# Altium schematic sheet SCH_WINGLET_GNSS.SchDoc: Winglet GNSS
size B; DrawnBy: HCAdam; Organization: Aerospace Village; DocumentNumber: WINGLET; Revision: A; SheetNumber: 7; SheetTotal: 10
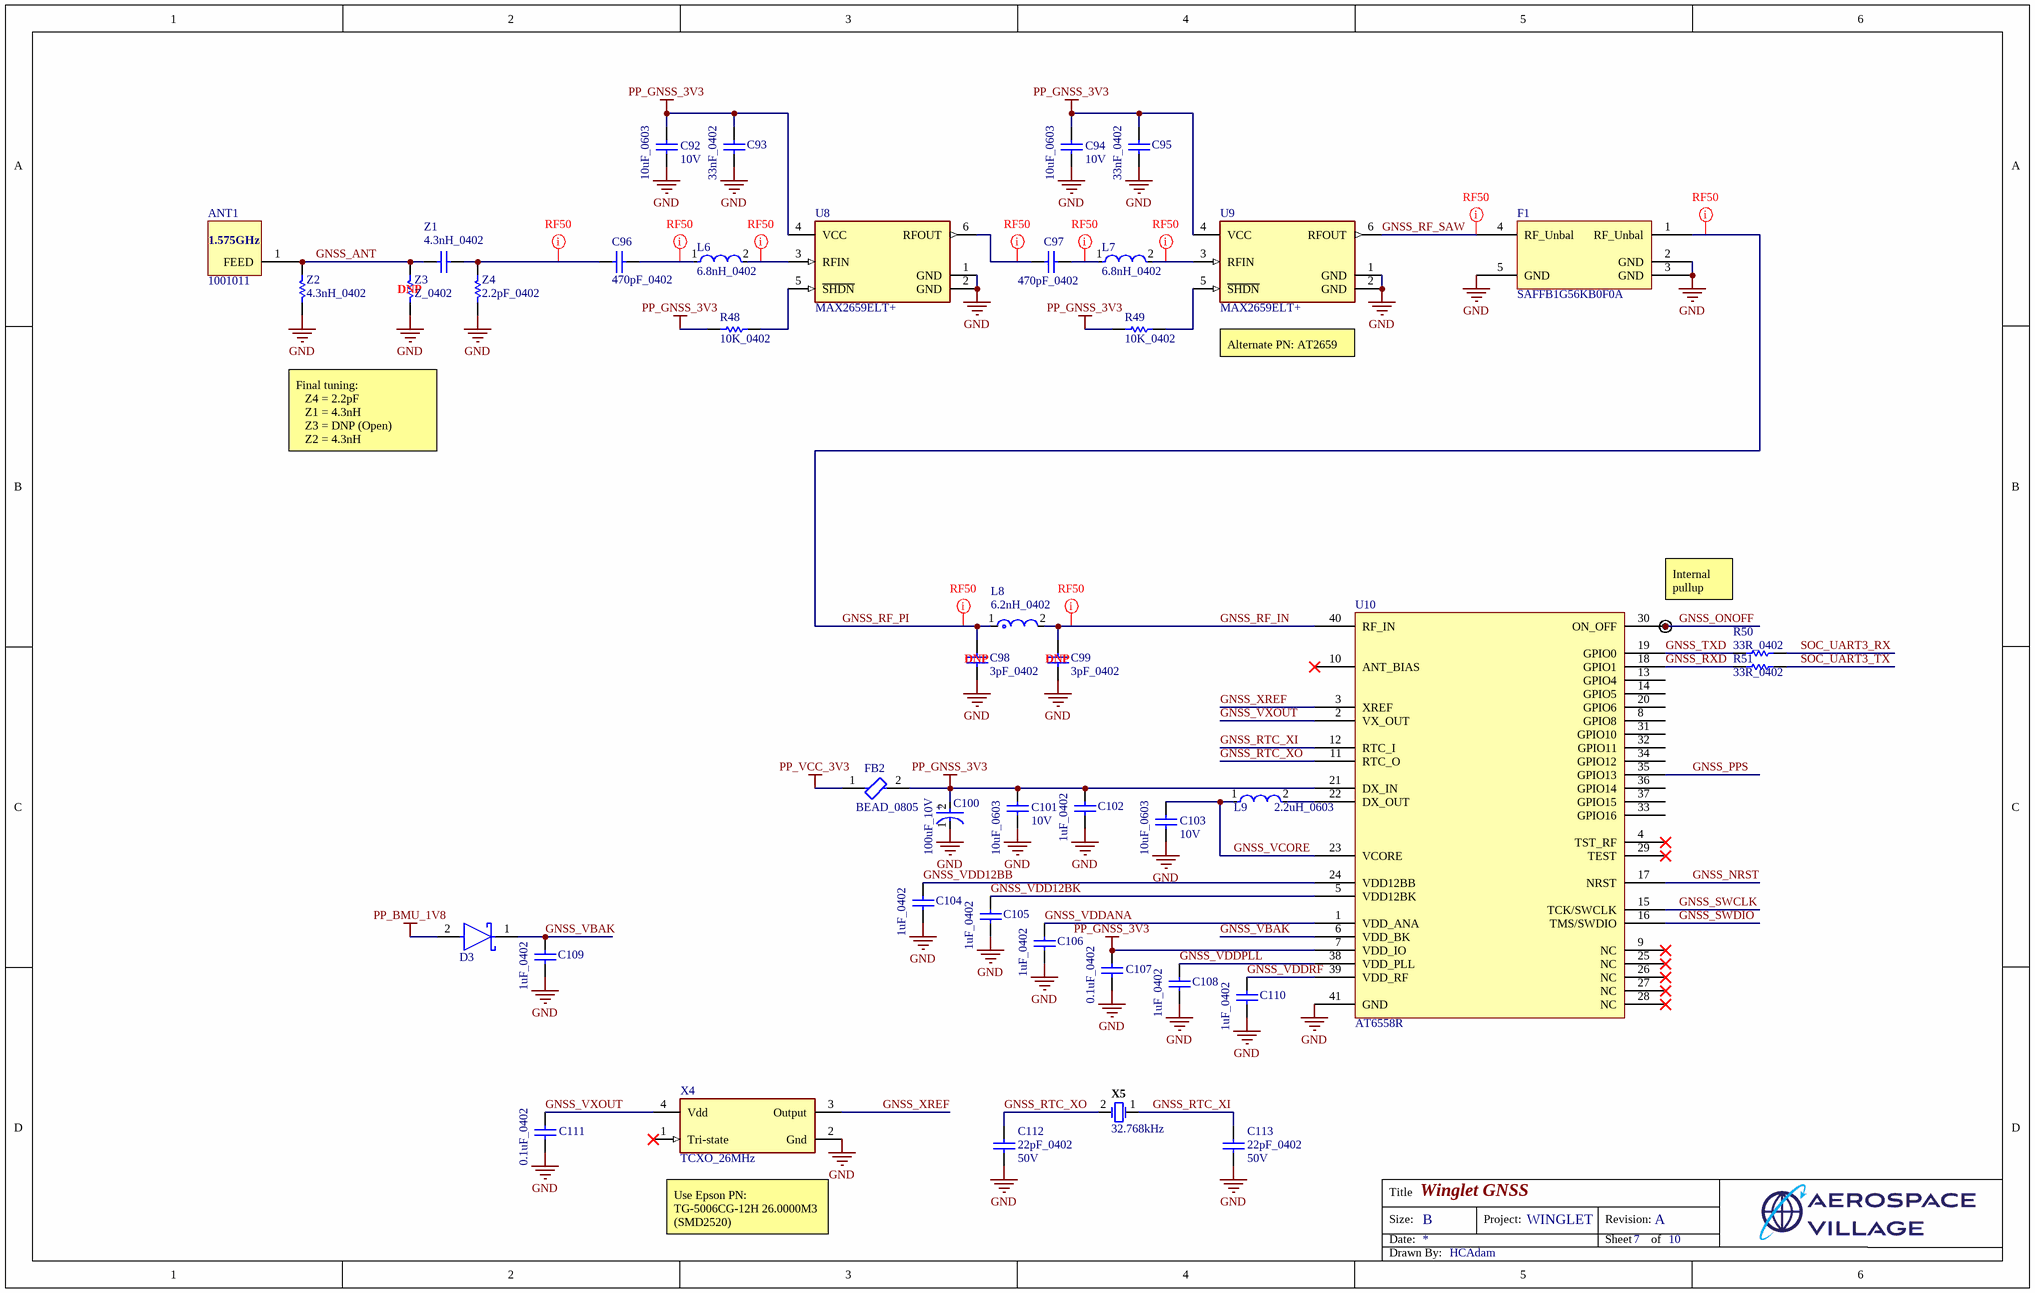
[diagram p0: SCH_WINGLET_GNSS.SchDoc]

## Parts
ANT1  1001011  [ANT1001011]
C92  10uF_0603  Voltage Rating: 10V  [CAPC1609X100X15NL20]
C93  33nF_0402  [CAPC1005X56X25NL10T15]
C94  10uF_0603  Voltage Rating: 10V  [CAPC1609X100X15NL20]
C95  33nF_0402  [CAPC1005X56X25NL10T15]
C96  470pF_0402  [CAPC1005X56X25NL10T15]
C97  470pF_0402  [CAPC1005X56X25NL10T15]
C98  3pF_0402  [CAPC1005X55X25NL05T10]
C99  3pF_0402  [CAPC1005X55X25NL05T10]
C100  100uF_10V  [FP-TAJB-MFG]
C101  10uF_0603  Voltage Rating: 10V  [CAPC1609X100X15NL20]
C102  1uF_0402  [CAPC1005X55X25NL5T10]
C103  10uF_0603  Voltage Rating: 10V  [CAPC1609X100X15NL20]
C104  1uF_0402  [CAPC1005X55X25NL5T10]
C105  1uF_0402  [CAPC1005X55X25NL5T10]
C106  1uF_0402  [CAPC1005X55X25NL5T10]
C107  0.1uF_0402  [CAPC1005X56X25NL10T15]
C108  1uF_0402  [CAPC1005X55X25NL5T10]
C109  1uF_0402  [CAPC1005X55X25NL5T10]
C110  1uF_0402  [CAPC1005X55X25NL5T10]
C111  0.1uF_0402  [CAPC1005X56X25NL10T15]
C112  22pF_0402  Voltage Rating: 50V  [CAPC1005X56X25LL10T15]
C113  22pF_0402  Voltage Rating: 50V  [CAPC1005X56X25LL10T15]
D3  BAT54KFILM  [FP-SOD-523-MFG]  (value not drawn)
F1  SAFFB1G56KB0F0A  [SAW80P110X50-5L]
FB2  BEAD_0805  [FP-BLM21-0_2-t0_85-e0_5-IPC_B]
L6  6.8nH_0402  [FP-LQW15AN_00-W0_6-0_1-MFG]
L7  6.8nH_0402  [FP-LQW15AN_00-W0_6-0_1-MFG]
L8  6.2nH_0402  [FP-LQG15HH_02-IPC_C]
L9  2.2uH_0603  [FP-MLZ1608-IPC_C]
R48  10K_0402  [RESC1005X40X25NL05T05]
R49  10K_0402  [RESC1005X40X25NL05T05]
R50  33R_0402  [RESC1005X40X25NL05T05]
R51  33R_0402  [RESC1005X40X25NL05T05]
TP27  TESTPOINT  [TESTPOINT-0.7MM-SINGLE-LAYER]  (value not drawn)  (no BOM)
U8  MAX2659ELT+  [FP-L611-2-MFG]
U9  MAX2659ELT+  [FP-L611-2-MFG]
U10  AT6558R  [QFN40P500X500X90_HS-41N]
X4  TCXO_26MHz  [FP-ECS-TXO-2520-MFG]
X5  32.768kHz  [ABRA-ABS07_A_V]
Z1  4.3nH_0402  [CAPC1006X50X20NL10T10]
Z2  4.3nH_0402  [RESC1005X40X25NL05T05]
Z3  Z_0402  [RESC1005X40X25NL05T05]
Z4  2.2pF_0402  [RESC1005X40X25NL05T05]

## Nets
GND: C92.1 C93.2 C94.1 C95.2 C98.1 C99.1 C100.1(C) C101.1 C102.1 C103.1 C104.1 C105.1 C106.1 C107.1 C108.1 C109.1 C110.1 C111.1 C112.1 C113.1 F1.2(GND) F1.3(GND) F1.5(GND) U8.1(GND) U8.2(GND) U9.1(GND) U9.2(GND) U10.41(GND) X4.2(Gnd) Z2.1 Z3.1 Z4.1
PP_BMU_1V8: D3.2(A)
PP_GNSS_3V3: C92.2 C93.1 C94.2 C95.1 C100.2(A) C101.2 C102.2 C107.2 FB2.2 R48.1 R49.1 U8.4(VCC) U9.4(VCC) U10.7(VDD_IO) U10.21(DX_IN)
PP_VCC_3V3: FB2.1
GNSS_ANT: ANT1.1(FEED) Z1.2 Z2.2 Z3.2
GNSS_NRST: U10.17(NRST)
GNSS_ONOFF: TP27.1 U10.30(ON_OFF)
GNSS_PPS: U10.35(GPIO13)
GNSS_RF_IN: C99.2 L8.2 U10.40(RF_IN)
GNSS_RF_PI: C98.2 F1.1(RF_Unbal) L8.1
GNSS_RF_SAW: F1.4(RF_Unbal) U9.6(RFOUT)
GNSS_RTC_XI: C113.2 U10.12(RTC_I) X5.1
GNSS_RTC_XO: C112.2 U10.11(RTC_O) X5.2
GNSS_RXD: R51.1 U10.18(GPIO1)
GNSS_SWCLK: U10.15(TCK/SWCLK)
GNSS_SWDIO: U10.16(TMS/SWDIO)
GNSS_TXD: R50.1 U10.19(GPIO0)
GNSS_VBAK: C109.2 D3.1(C) U10.6(VDD_BK)
GNSS_VCORE: C103.2 L9.1 U10.23(VCORE)
GNSS_VDD12BB: C104.2 U10.24(VDD12BB)
GNSS_VDD12BK: C105.2 U10.5(VDD12BK)
GNSS_VDDANA: C106.2 U10.1(VDD_ANA)
GNSS_VDDPLL: C108.2 U10.38(VDD_PLL)
GNSS_VDDRF: C110.2 U10.39(VDD_RF)
GNSS_VXOUT: C111.2 U10.2(VX_OUT) X4.4(Vdd)
GNSS_XREF: U10.3(XREF) X4.3(Output)
SOC_UART3_RX: R50.2
SOC_UART3_TX: R51.2
NetC96_1: C96.1 L6.1
NetC96_2: C96.2 Z1.1 Z4.2
NetC97_1: C97.1 L7.1
NetC97_2: C97.2 U8.6(RFOUT)
NetL6_2: L6.2 U8.3(RFIN)
NetL7_2: L7.2 U9.3(RFIN)
NetL9_2: L9.2 U10.22(DX_OUT)
NetR48_2: R48.2 U8.5(~{SHDN})
NetR49_2: R49.2 U9.5(~{SHDN})

Not connected (* = marked no-connect by the designer): U10 4(TST_RF)* 8(GPIO8) 9(NC)* 10(ANT_BIAS)* 13(GPIO4) 14(GPIO5) 20(GPIO6) 25(NC)* 26(NC)* 27(NC)* 28(NC)* 29(TEST)* 31(GPIO10) 32(GPIO11) 33(GPIO16) 34(GPIO12) 36(GPIO14) 37(GPIO15); X4 1(Tri-state)*

## Layout directives
net class RF_50Z: GNSS_RF_IN, GNSS_RF_PI, GNSS_RF_SAW, NetC96_1, NetC96_2, NetC97_1, NetC97_2, NetL6_2, NetL7_2

## Notes on the sheet
- (near U9) Alternate PN: AT2659
- Final tuning:
  Z4 = 2.2pF
  Z1 = 4.3nH
  Z3 = DNP (Open)
  Z2 = 4.3nH
- (near TP27) Internal pullup
- (near X4) Use Epson PN: TG-5006CG-12H 26.0000M3 (SMD2520)
- Title
- Size:
- Date:
- B
- Project:
- Revision:
- Sheet
- of
- Drawn By:
- (in symbol 1001011) 1.575GHz
- (in symbol CMP-04424-000366-1) +

## Library data of the parts
ANT1 = 1001011: GPS/GLONASS/Beidou/Galileo (On/Off Ground) or ISM FR4 Antenna / 1.561, 1.575, 1.603 GHz or 868-928 MHz
C92 C94 C101 C103 = CMP-2006-00191-1: Part Number: TACL106M006XTA; Manufacturer: AVX Interconnect / Elco
C93 C95-C97 = CMP-2008-02743-1
C98 C99 = CMP-1034-00238-2: GRM1555C1H3R0BA01D; Manufacturer: Murata; Part Number: GRM1555C1H3R0BA01D; DNP: DNP
C100 = CMP-04424-000366-1: 100uF 10V ±10% 1.7Ω SMD CASE-B (3528) Tantalum Capacitor; Voltage Rating (DC): 6.3V; ESR (Equivalent Series Resistance): 1.7R; Polarity: Polar; Leakage Current: 6.3uA; Height: 1.9mm; Depth: 2.8mm; Length: 3.5mm; Min Operating Temperature: -55°C; Width: 2.8mm; Series: TAJ; Lead Free: Lead Free; Case/Package: 1210; Voltage: 6.3V; Mount: Surface Mount; Tolerance: 10%; Capacitance: 100uF; Radiation Hardening: No; REACH SVHC: No SVHC; Voltage Rating: 6.3V; Case Code (Metric): 3528; Dissipation Factor: 10%; Packaging: Tape and Reel; Construction: Flat; Features: General Purpose; Max Operating Temperature: 125°C; RoHS Compliant: Yes; Package Quantity: 1; Dielectric Material: Tantalum; Termination: SMD/SMT; Case Code (Imperial): 1210; Height - Seated (Max): 0.083inch
C102 C104-C106 C108-C110 = CMP-1662-00020-1: Chip Capacitor, 1 uF, +/- 10%, 6.3 V, -55 to 85 degC, 0402 (1005 Metric), RoHS, Tape and Reel / GRM155R60J105KE19D; Voltage Rating (DC): 3 V; Type (Capacitors): X5R; Voltage Rating: 6.3 V; Capacitance: 1 uF; ComponentLink2Description: Datasheet; ComponentLink2URL: http://psearch.en.murata.com/capacitor/product/GRM155R60J105KE19%23.pdf; Max Operating Temperature: 85 degC; Min Operating Temperature: -55 degC; Package Quantity: 10000; Mounting Technology: Surface Mount; ComponentLink1Description: Manufacturer URL; ComponentLink1URL: http://www.murata.com/; PackageDescription: 2-Pin Surface Mount Device, Body 1 x 0.5 mm; Tolerance: 10%; Case/Package: 0402; Mount: Surface Mount; Packaging: Tape and Reel; Case Code (Metric): 1005; Radiation Hardening: No; Width: 0.5 mm; Length: 1 mm; DatasheetVersion: 08/2016; Height: 0.5 mm; PartNumber: GRM155R60J105KE19D; RoHSCompliant: true; Case Code (Imperial): 0402; REACH SVHC: No SVHC; Pins: 2
C107 C111 = CMP-2008-02743-1: 04026D104KAT2A; Manufacturer: AVX Interconnect / Elco; Voltage Rating: 6.3V; Part Number: 04026D104KAT2A
C112 C113 = CMP-2008-02613-1: 04025A220JAT2A; Manufacturer: AVX Interconnect / Elco; Part Number: 04025A220JAT2A
D3 = CMP-12187-000026-1: DIODE SCHOTTKY 40V 300MA SOD523; Manufacturer: STMicroelectronics; Capacitance: 7pF; Value: 7pF; Max Surge Forward Current: 1.25A; Peak Reverse Current: 1uA; Max Junction Temp: +150°C; Device Class L2: Diodes; Temperature Range Low: -40°C; Category: Diode; Manufacturer Part Number: BAT54KFILM; Digikey Description: DIODE SCHOTTKY 40V 300MA SOD523; Device Class L3: Schottky Diodes; Automotive: No; Height: 0.7mm; Octopart: https://octopart.com/bat54kfilm-stmicroelectronics-39618022; ComponentLink2Description: Datasheet; Temperature Range High: +150°C; Device Class L1: Discrete Semiconductors; Max Repetitive Reverse Voltage: 40V; RoHS: TRUE; Temperature: -40°C to +150°C; ComponentLink2URL: https://www.st.com/content/ccc/resource/technical/document/datasheet/07/50/54/f2/0d/ba/4a/79/CD00001322.pdf/files/CD00001322.pdf/jcr:content/translations/en.CD00001322.pdf; Lead Free: Yes; Forward Current: 300mA; Package: SOD-523; Mouser Description: Schottky Diodes & Rectifiers schottky diode
F1 = SAFFB1G56KB0F0A: SAW FILTER FOR GPS/GLONASS/BEIDOU2 / 1561.10/1575.42/1602 MHz
FB2 = CMP-0686-00717-3: Chip Ferrite Bead, 0805, 150Ω @ 100MHz, 0.09Ω, 25%, 1A; Number of Circuits: 1; Max Current Rating: 800mA; DC Resistance (DCR): 100mR; Shielding: Unshielded; DC Current: 200mA; Impedance: 150R; Contact Plating: Tin; Weight: 0.000194oz; Series: EMIFIL®, BLM21A; Core Material: Ferrite; Test Frequency: 100MHz; Case Code (Metric): 2012; Package Quantity: 4000; Lead Free: Lead Free; Max Operating Temperature: 125°C; Case Code (Imperial): 0805; Material: Ferrite; Min Operating Temperature: -55°C; Tolerance: 25%; Length: 2mm; DC Resistance-Max: 100mR; Width: 1.25mm; RoHS Compliant: Yes; Packaging: Tape and Reel; REACH SVHC: No SVHC; Depth: 1.45mm; Number of Pins: 2; Radiation Hardening: No; Current Rating: 800mA; Height: 0.85mm; Termination: SMD/SMT; Number of Lines: 1; Max DC Current: 200mA; Case/Package: 0805
L6 L7 = CMP-06042-011849-1: Wire Wound RF Inductor 6.8nH ±3% 700mA 0.09Ω 0402 (1005) / LQW15AN6N8H00D; Self Resonant Frequency: 6GHz; Current: 540mA; Shielding: Unshielded; Q Factor: 25; DC Resistance (DCR): 90mR; Test Frequency: 100MHz; Core Material: Air; Min Operating Temperature: -55°C; Case Code (Imperial): 0402; Radiation Hardening: No; Depth: 0.7mm; Height - Seated (Max): 0.024inch; Weight: 2.8E-05oz; Package Quantity: 10000; Width: 0.02inch; Length: 1mm; Max Operating Temperature: 125°C; Max DC Current: 700mA; Military Standard: Not; Resistor Type: Wirewound; Packaging: Tape and Reel; Termination: SMD/SMT; Case/Package: 0402; Height: 0.5mm; Case Code (Metric): 1005; DC Current: 700mA; Mount: Surface Mount; Current Rating: 700mA; Tolerance: 3%; Inductance: 6.8nH
L8 = CMP-06042-000330-1: Multilayer type RF Inductor 6.2nH ±0.3nH 0.19Ω 600mA 0402 / LQG15HN6N2S02D; DC Resistance (DCR): 270mR; Self Resonant Frequency: 4.3GHz; Core Material: Air; Current Rating: 300mA; Q Factor: 8; Shielding: Unshielded; Test Frequency: 100MHz; Width: 0.02inch; Height - Seated (Max): 0.022inch; Lead Free: Lead Free; Military Standard: Not; Height: 0.02inch; Packaging: Tape and Reel; Depth: 0.55mm; Case/Package: 0402; Length: 0.039inch; Inductance: 6.2nH; Max DC Current: 300mA; REACH SVHC: No SVHC; Mount: Surface Mount; Number of Pins: 2; Min Operating Temperature: -55°C; Case Code (Metric): 1005; DC Current: 300mA; Package Quantity: 1; Max Operating Temperature: 125°C; Case Code (Imperial): 0402; Radiation Hardening: No; Termination: SMD/SMT
L9 = CMP-08253-000367-1: Shielded Multilayer Inductor 2.2uH ±20% 500mA 234mΩ SMD 0603 / MLZ1608N2R2LT000; Test Frequency: 2MHz; Core Material: Ferrite; DC Resistance (DCR): 234mR; Saturation Current: 110mA; Self Resonant Frequency: 120MHz; Case Code (Metric): 1608; Mount: Surface Mount; Length: 0.063inch; Shielding: Shielded; Inductance: 2.2uH; Width: 0.031inch; Case Code (Imperial): 0603; Height - Seated (Max): 0.037inch; Package Quantity: 4000; Packaging: Tape and Reel; Min Operating Temperature: -55°C; Current Rating: 500mA; Lead Free: Lead Free; RoHS Compliant: Yes; Max Operating Temperature: 125°C; Tolerance: 20%; Case/Package: 0603
R48 R49 Z2-Z4 = CMP-2000-07588-1: Chip Resistor, 10 KOhm, +/- 1%, 0.1 W, -55 to 155 degC, 0402 (1005 Metric), RoHS, Tape and Reel / ERJ2RKF1002X; Manufacturer: Panasonic; Power Rating: 100mW; Voltage Rating: 50V; Resistance: 10KOhm; Case\/Package: 0402; Temperature Coefficient: 100ppm\/degreesC; RoHSCompliant: True; Lead Free: LeadFree; Package Quantity: 1; Contact Plating: Tin; Length: 1mm; Radiation Hardening: No; REACH SVHC: NoSVHC; Max Operating Temperature: 155degC; Depth: 0.5mm; Case Code (Imperial): 0402; Military Standard: Not; Package Description: 2-Pin Surface Mount Device, Body 1 x 0.5 mm; Termination: SMD/SMT; Case Code (Metric): 1005; Height: 0.35mm; Packaging: TapeandReel; Voltage Rating (DC): 50V; Package Reference: 402; Number of Pins: 2; Tolerance: 1%; Mounting Technology: SurfaceMount; Width: 0.02inch; Mount: SurfaceMount; Datasheet URL: https://industrial.panasonic.com/cdbs/www-data/pdf/RDA0000/AOA0000C304.pdf; Composition: ThickFilm; Datasheet Version: 02/2017; Manufacturer URL: http://www.panasonic.com/; Max Power Dissipation: 100mW; Number of Terminations: 2; Min Operating Temperature: -55degC
  Z3: DNP: DNP
R50 R51 = CMP-2002-01146-1: ERJ2RKF33R0X; Manufacturer: Panasonic; Part Number: ERJ2RKF33R0X
TP27 = TP_07: TESTPOINT SINGLE LAYER 0.7MM; AEC-Q: Yes; PPAP: Unknown; Selective Soldering: No; Value: Unknown; RoHS: Yes; Package: BOARD_FEATURE; Washable: Yes; Mounting: Unknown
U8 U9 = CMP-05725-000003-1: GPS Amp Single Low Noise 1.75GHz 3.6V 6-Pin UDFN; Number of Pins: 6; Contact Plating: Gold
U10 = AT6558R: GNSS/BDS Satellite Positioning SOC
X4 = CMP-40224-000034-1: XTAL OSC TCXO 25.0000MHZ HCMOS / !!! SUBSTITUTE !!!; RoHS Compliant: Yes
X5 = CMP-2000-07587-1: Tuning Fork Crystal, 32.768 KHz, +/- 20 ppm, -40 to 85 degC, 2-Pin SMD, RoHS, Tape and Reel, PN ABS07-120-32.768KHZ-T; Manufacturer: Abracon; Case\/Package: SMD/SMT; Series Resistance: 60KOhm; Frequency Tolerance: 20ppm; Load Capacitance: 6pF; ESR (Equivalent Series Resistance): 55KOhm; Max Operating Temperature: 85degC; Width: 0.061inch; Radiation Hardening: No; Lead Free: LeadFree; RoHSCompliant: True; Depth: 1.5mm; Datasheet URL: http://www.abracon.com/Resonators/ABS07-120-32.768kHz-T.pdf; Frequency: 32.768KHz; Termination: SMD/SMT; Manufacturer URL: http://www.abracon.com/; Package Quantity: 3000; Packaging: TapeandReel; Number of Pins: 2; Height: 0.035inch; Package Description: 2-Pin Surface Mount Device, Body 3.2 x 1.5 mm; Package Reference: ABS07; Mount: SurfaceMount; Tolerance: 20ppm; Mounting Technology: SurfaceMount; REACH SVHC: NoSVHC; Datasheet Version: 11/2014; Length: 3.2mm; Min Operating Temperature: -40degC
Z1 = CMP-2008-04764-1: 04023J1R6ABSTR; Manufacturer: AVX Interconnect / Elco; Part Number: 04023J1R6ABSTR